# EAGLE design zxld400-9-leds-mk-1 (EAGLE 6.5.0)
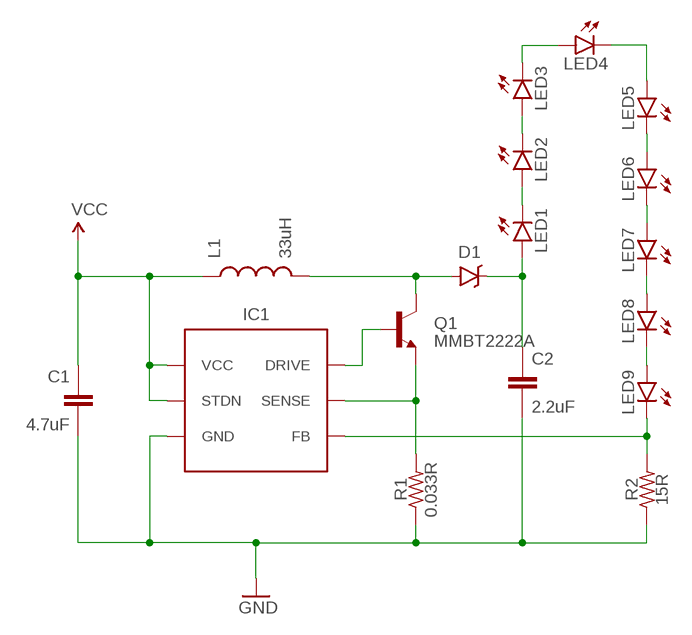
[diagram p0: schematic, sheet 1]

## Parts
C1  4.7uF  CAPACITOR-CERAMICC0805  [C0805]
C2  2.2uF  CAPACITOR-CERAMICC0805  [C0805]
D1  DIODE-SCHOTTKYSMA  [SMA-DIODE-SCHOTTKY]
IC1  ZXSC400  [SOT23-6]
L1  33uH  INDUCTORTAIYO-YUDEN-30XX  [TAIYO-YUDEN-30XX]
LED1  LED5MM_SHORTPADS  [LED5MM_SHORTPADS]
LED2  LED5MM_SHORTPADS  [LED5MM_SHORTPADS]
LED3  LED5MM_SHORTPADS  [LED5MM_SHORTPADS]
LED4  LED5MM_SHORTPADS  [LED5MM_SHORTPADS]
LED5  LED5MM_SHORTPADS  [LED5MM_SHORTPADS]
LED6  LED5MM_SHORTPADS  [LED5MM_SHORTPADS]
LED7  LED5MM_SHORTPADS  [LED5MM_SHORTPADS]
LED8  LED5MM_SHORTPADS  [LED5MM_SHORTPADS]
LED9  LED5MM_SHORTPADS  [LED5MM_SHORTPADS]
Q1  MMBT2222A  TRANSISTOR_NPNMMBT2222A  [SOT23-3]
R1  0.033R  RESISTORR0805  [R0805]
R2  15R  RESISTORR0603  [R0603]

## Nets
GND: C1.2 C2.2 IC1.2(GND) R1.1 R2.1
N$1: D1.A L1.2 Q1.3(C)
N$2: IC1.6(DRIVE) Q1.1(B)
N$3: IC1.4(SENSE) Q1.2(E) R1.2
N$4: C2.1 D1.C LED1.A
N$5: LED1.K(C) LED2.A
N$6: LED2.K(C) LED3.A
N$7: LED3.K(C) LED4.A
N$8: LED4.K(C) LED5.A
N$9: LED5.K(C) LED6.A
N$10: LED6.K(C) LED7.A
N$11: LED7.K(C) LED8.A
N$12: LED8.K(C) LED9.A
N$13: IC1.5(FB) LED9.K(C) R2.2
VCC: C1.1 IC1.1(VCC) IC1.3(STDN) L1.1

## Library data of the parts
C1 C2 = A_butts:CAPACITOR-CERAMIC: CAPACITOR, European symbol
D1 = A_butts:DIODE-SCHOTTKY: Schottky diodes in SFE's production catalog BAT20J 1A 23V 0.62Vf RB751 120mA 40V 0.37Vf PMEG4005EJ 0.5A 40V 0.42Vf MBRA140 1A 40V 0.5Vf B340A 3A 40V SMA
IC1 = A_butts:ZXSC400
L1 = A_butts:INDUCTOR: Inductors Basic Inductor/Choke - 0603 and 1206. Footprints are not proven and vary greatly between part numbers. SRN6045- 33uH, 20% 1.4A SDR0403-560KL - 56uH, 10%, 500mA RMS/740mA peak
LED1-LED9 = A_butts:LED: LEDs Standard schematic elements and footprints for 5mm, 3mm, 1206, and 0603 sized LEDs. 5mm - Spark Fun Electronics SKU : COM-00529 (and others)
Q1 = A_butts:TRANSISTOR_NPN: Generic NPN BJT MMBT2222A - TRANS-08049 (SOT-23, 1A 40V) MPSA42 - TRANS-09116 (SOT-23, 500mA 300V) MMBT5088LT1G - TRANS-11160 (SOT-23, 50 mA 30V) BC547 - COM-08928 <http://www.sparkfun.com/products/8928> (TO-92 45V 100mA) (1.Collector 2.Base 3.Emitter) 2N3904 - COM-00521 <http://www.sparkfun.com/products/521> (TO-92 40V 200mA) (1.Emitter 2.Base 3.Collector) P2N2222A - COM-12852 <http://www.sparkfun.com/products/12852> (TO-92 40V 600mA) (1.Collector 2.Base 3.Emitter); PROD_ID: TRANS-08049
R1 R2 = A_butts:RESISTOR: RESISTOR, American symbol

## Board
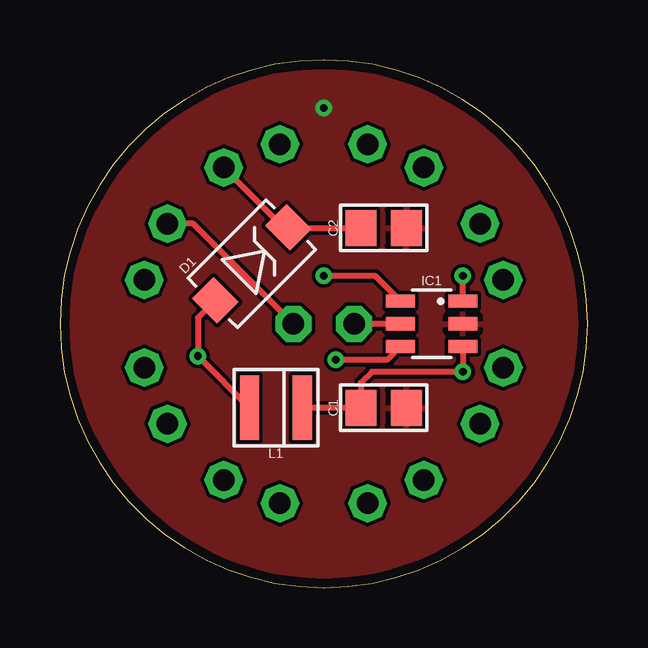
[diagram p1: board, top side]
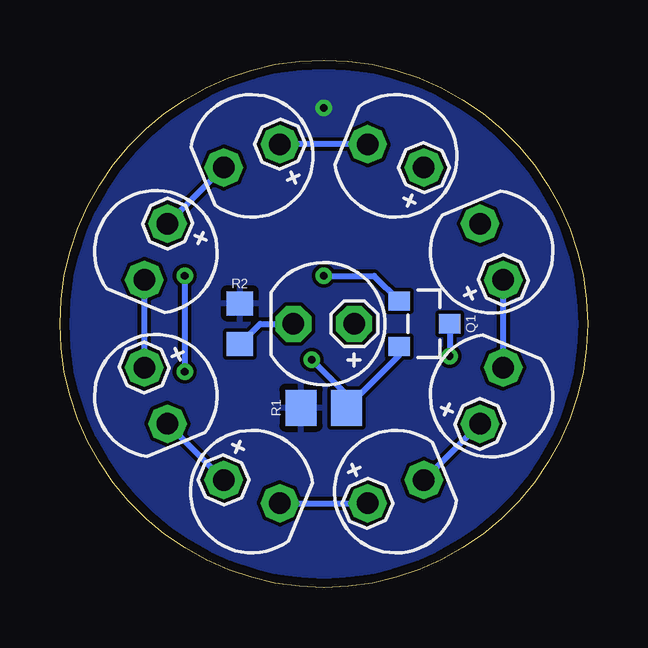
[diagram p2: board, bottom side, seen from below]

Size 22 x 22 mm. Coordinates in mm from the lower left corner, seen from the top.
Outline: 0,11 arc90 11,0 arc90 22,11 arc90 11,22 arc90 0,11
Copper layers (1*16): Top 0.0356mm / dielectric 1.5011mm / Bottom 0.0356mm
Design rules "LaenPCBOrder2": minimum track width 6mil, minimum drill 13mil, track to track 6mil, track to pad 6mil, pad to pad 6mil, via to via 6mil, smd to smd 6mil, copper to edge 15mil, drill to drill 6mil, minimum pad ring 7mil, minimum via ring 7mil, stop-mask expansion 3mil, vias tented up to drill 20mil, thermal gap 10mil

### Footprints (pad centres in the part's own frame; a part is rotated, then mirrored left to right if it is on the bottom)
C0805 = smd 1.3 x 1.5: 1 -0.95,0; 2 0.95,0
SMA-DIODE-SCHOTTKY = smd 1.27 x 1.47: A -2.15,0; C 2.15,0
SOT23-6 = smd 0.55 x 1.2: 1 0.95,-1.3; 2 0,-1.3; 3 -0.95,-1.3; 4 -0.95,1.3; 5 0,1.3; 6 0.95,1.3
TAIYO-YUDEN-30XX = smd 0.8 x 2.7: 1 -1.1,0; 2 1.1,0
LED5MM_SHORTPADS = drill 0.9 pad 1.5 octagon: A -1.27,0; K 1.27,0
SOT23-3 = smd 0.8 x 0.9: 1 -0.95,-1; 2 0.95,-1; 3 0,1.1
R0805 = smd 1.3 x 1.5: 1 -0.95,0; 2 0.95,0
R0603 = smd 1 x 1.1: 1 -0.85,0; 2 0.85,0

### Placement (x,y rotation side)
C1  13.5,7.5 0 top
C2  13.5,15 0 top
D1  8,13.5 45 top
IC1  15.5,11 90 top
L1  9,7.5 180 top
LED1  8,18 157.5 bottom
LED2  14,18 202.5 bottom
LED3  18,14 247.5 bottom
LED4  18,8 292.5 bottom
LED5  14,4 337.5 bottom
LED6  8,4 22.5 bottom
LED7  4,8 67.5 bottom
LED8  4,14 112.5 bottom
LED9  11,11 180 bottom
Q1  6.85,11 270 bottom
R1  11,7.5 0 bottom
R2  14.5,11 270 bottom

### Tracks (layer width: path | path; a pad name or v marks a point on that pad's centre or on a via)
GND  (via drill 0.33)
  other vias: 11,20
  pour Top: 11,0 arc-90 0,11 arc-90 11,22 arc-90 22,11 arc-90
  pour Bottom: 11,0 arc-90 0,11 arc-90 11,22 arc-90 22,11 arc-90
N$1  (via drill 0.33)
  Top 0.25: L1.2 v5.75,9.65 5.75,11.25 D1.A
  Bottom 0.25: Q1.3 v5.75,9.65
N$2  (via drill 0.33)
  Top 0.25: IC1.6 13.15,13 v11,13
  Bottom 0.25: v11,13 8.9,13 Q1.1
N$3  (via drill 0.33)
  Top 0.25: IC1.4 13.65,9.5 v11.5,9.5
  Bottom 0.25: Q1.2 7.85,9.7 R1.2 10.05,8.05 v11.5,9.5
N$4
  Top 0.25: C2.1 9.54,15 D1.C 9.32,15.02 LED1.A
N$5
  Bottom 0.25: LED1.K LED2.A
N$6
  Bottom 0.25: LED2.K LED3.A
N$7
  Bottom 0.25: LED3.K LED4.A
N$8
  Bottom 0.25: LED4.K LED5.A
N$9
  Bottom 0.25: LED5.K LED6.A
N$10
  Bottom 0.25: LED6.K LED7.A
N$11
  Bottom 0.25: LED7.K LED8.A
N$12
  Top 0.25: LED9.A 5.56,15.17 LED8.K
N$13
  Top 0.25: IC1.5 LED9.K
  Bottom 0.25: R2.2 13.65,11 LED9.K
VCC  (via drill 0.33)
  Top 0.25: L1.1 C1.1 12.55,8.55 13,9 v16.8,9 IC1.3 | IC1.1 v16.8,13
  Bottom 0.25: v16.8,13 v16.8,9